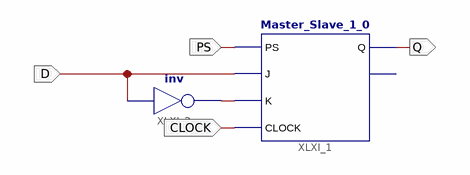
[diagram p0: schematic sheet 1]
// Xilinx ISE schematic D_FF_1_0.sch (artix7) as structural Verilog: 2 symbols, 4 ports
module D_FF_1_0 (
  input  D,
  input  PS,
  input  CLOCK,
  output Q
);

  wire XLXN_2;

  Master_Slave_1_0 XLXI_1 (.CLOCK(CLOCK), .J(D), .K(XLXN_2), .PS(PS), .Q(Q));  // open: Qb
  not XLXI_2 (XLXN_2, D);
endmodule
